# EAGLE design MucDuino_Strawberry (EAGLE 6.5.0)
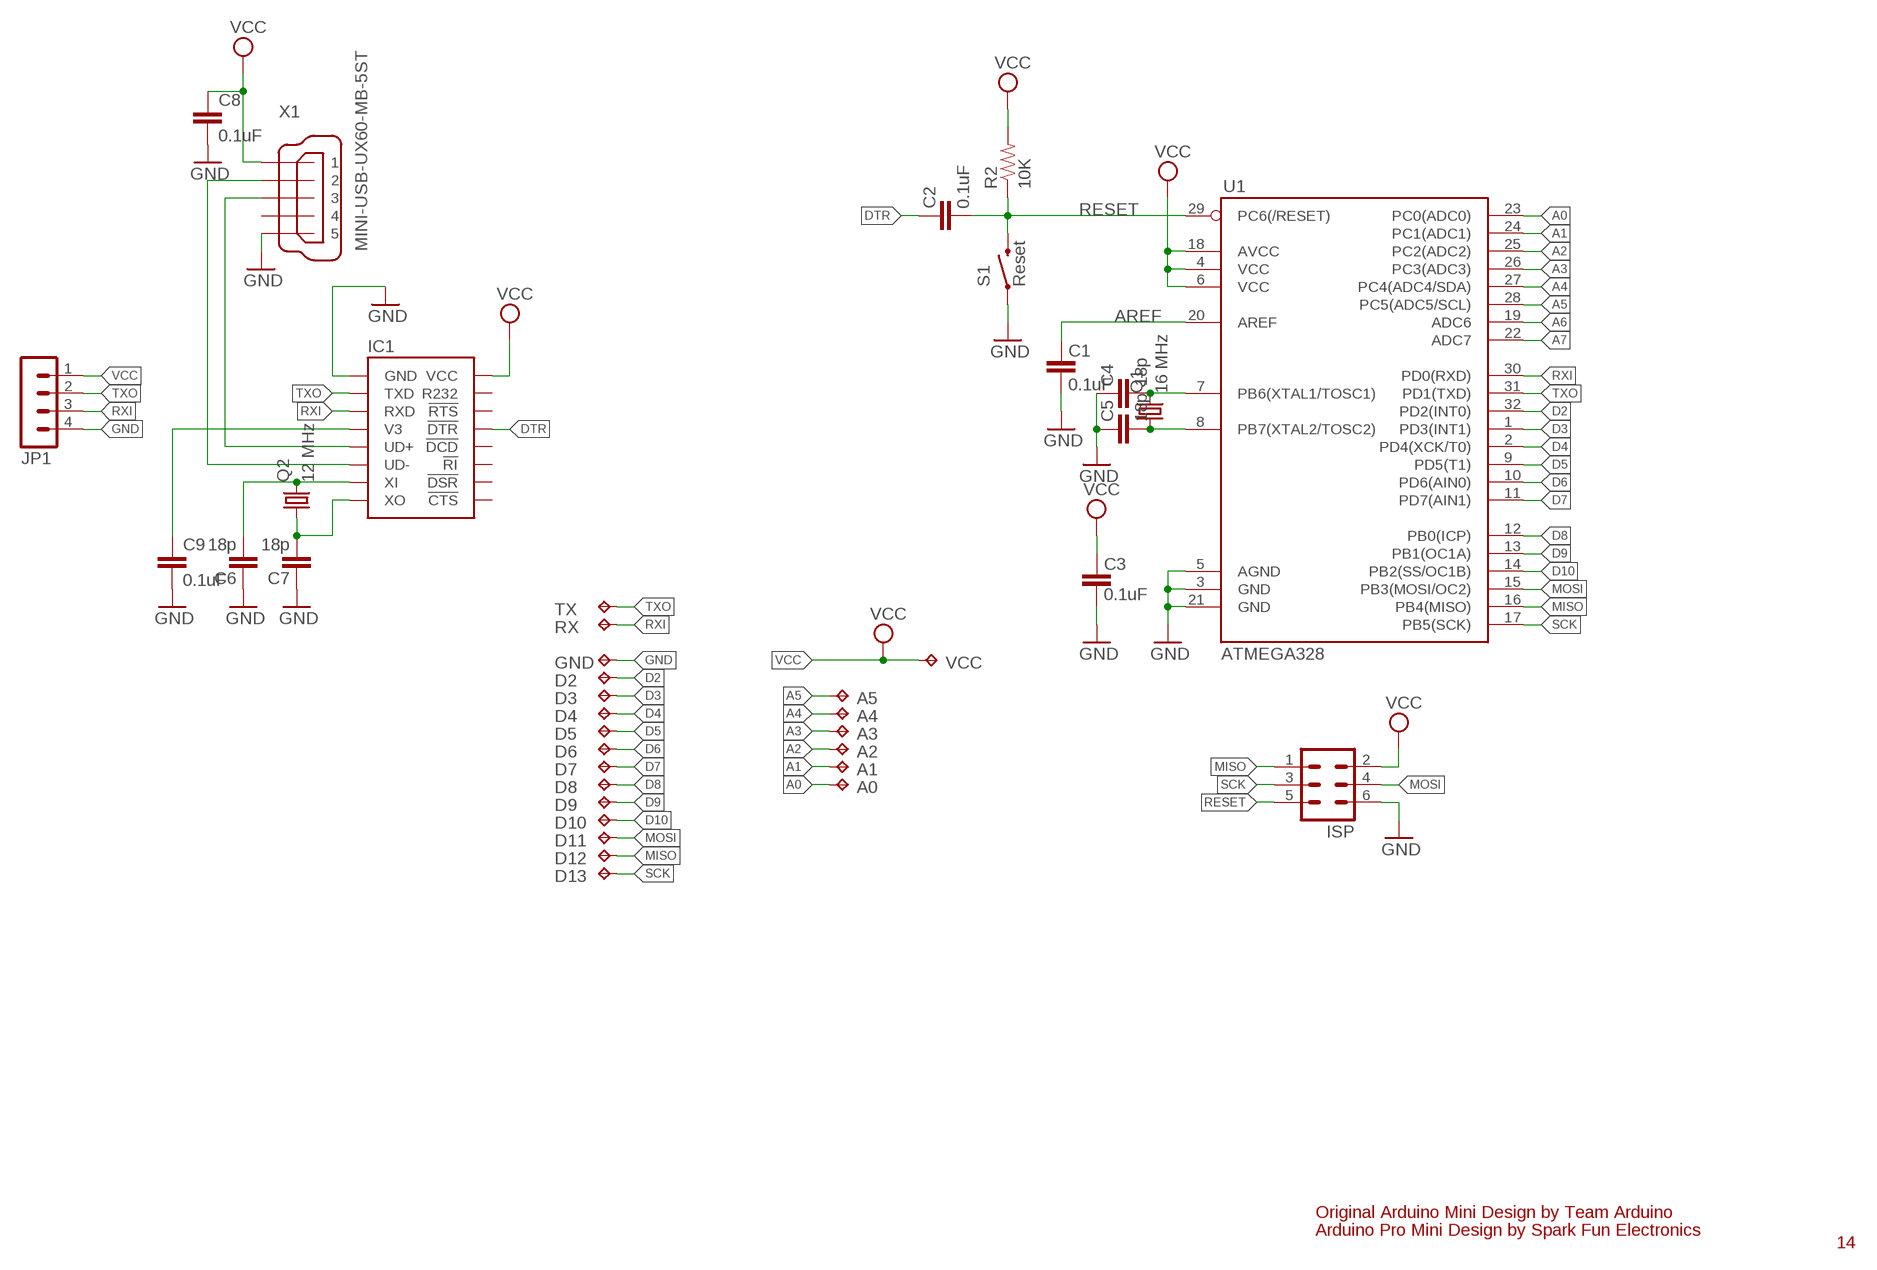
[diagram p0: schematic, sheet 1]

## Parts
A0  TPPAD1-13  [P1-13]
A1  TPPAD1-13  [P1-13]
A2  TPPAD1-13  [P1-13]
A3  TPPAD1-13  [P1-13]
A4  TPPAD1-13  [P1-13]
A5  TPPAD1-13  [P1-13]
C1  0.1uF  CAP0603-CAP  [0603-CAP]
C2  0.1uF  CAP0603-CAP  [0603-CAP]
C3  0.1uF  CAP0603-CAP  [0603-CAP]
C4  18p  CAP0603-CAP  [0603-CAP]
C5  18p  CAP0603-CAP  [0603-CAP]
C6  18p  CAP0603-CAP  [0603-CAP]
C7  18p  CAP0603-CAP  [0603-CAP]
C8  0.1uF  CAP0603-CAP  [0603-CAP]
C9  0.1uF  CAP0603-CAP  [0603-CAP]
D2  TPPAD1-13  [P1-13]
D3  TPPAD1-13  [P1-13]
D4  TPPAD1-13  [P1-13]
D5  TPPAD1-13  [P1-13]
D6  TPPAD1-13  [P1-13]
D7  TPPAD1-13  [P1-13]
D8  TPPAD1-13  [P1-13]
D9  TPPAD1-13  [P1-13]
D10  TPPAD1-13  [P1-13]
D11  TPPAD1-13  [P1-13]
D12  TPPAD1-13  [P1-13]
D13  TPPAD1-13  [P1-13]
GND  TPPAD1-13  [P1-13]
IC1  CH340G  [SOP16-209MM]
ISP  MA03-2  [MA03-2]
JP1  MA04-1  [MA04-1]
Q1  16 MHz  CRYSTALHC49UP  [HC49UP]
Q2  12 MHz  CRYSTALHC49UP  [HC49UP]
R2  10K  RESISTOR0603-RES  [0603-RES]
RX  TPPAD1-13  [P1-13]
S1  Reset  SWITCH-MOMENTARY-2SMD-ALT01  [TACTILE-SWITCH-SMD-ALT01]
TX  TPPAD1-13  [P1-13]
U1  ATMEGA328  ATMEGA168  [TQFP32-08]
VCC  TPPAD1-13  [P1-13]
X1  MINI-USB-UX60-MB-5ST  [UX60-MB-5ST]

## Nets
A0: A0.TP U1.23(PC0(ADC0))
A1: A1.TP U1.24(PC1(ADC1))
A2: A2.TP U1.25(PC2(ADC2))
A3: A3.TP U1.26(PC3(ADC3))
A4: A4.TP U1.27(PC4(ADC4/SDA))
A5: A5.TP U1.28(PC5(ADC5/SCL))
A6: U1.19(ADC6)
A7: U1.22(ADC7)
AREF: C1.2 U1.20(AREF)
D2: D2.TP U1.32(PD2(INT0))
D3: D3.TP U1.1(PD3(INT1))
D4: D4.TP U1.2(PD4(XCK/T0))
D5: D5.TP U1.9(PD5(T1))
D6: D6.TP U1.10(PD6(AIN0))
D7: D7.TP U1.11(PD7(AIN1))
D8: D8.TP U1.12(PB0(ICP))
D9: D9.TP U1.13(PB1(OC1A))
D10: D10.TP U1.14(PB2(SS/OC1B))
DTR: C2.2 IC1.P$13(!DTR)
GND [vcc]: C1.1 C3.1 C4.2 C5.2 C6.2 C7.2 C8.2 C9.2 GND.TP IC1.P$1(GND) ISP.6 JP1.4 S1.1 S1.2 U1.3(GND) U1.5(AGND) U1.21(GND) X1.5
MISO: D12.TP ISP.1 U1.16(PB4(MISO))
MOSI: D11.TP ISP.4 U1.15(PB3(MOSI/OC2))
N$1: C5.1 Q1.1 U1.8(PB7(XTAL2/TOSC2))
N$2: C4.1 Q1.2 U1.7(PB6(XTAL1/TOSC1))
N$3: C9.1 IC1.P$4(V3)
N$5: C6.1 IC1.P$7(XI) Q2.2
N$6: C7.1 IC1.P$8(XO) Q2.1
N$8: IC1.P$5(UD+) X1.3
N$9: IC1.P$6(UD-) X1.2
RESET: C2.1 ISP.5 R2.1 S1.3 S1.4 U1.29(PC6(/RESET))
RXI: IC1.P$3(RXD) JP1.3 RX.TP U1.30(PD0(RXD))
SCK: D13.TP ISP.3 U1.17(PB5(SCK))
TXO: IC1.P$2(TXD) JP1.2 TX.TP U1.31(PD1(TXD))
VCC: C3.2 C8.1 IC1.P$16(VCC) ISP.2 JP1.1 R2.2 U1.4(VCC) U1.6(VCC) U1.18(AVCC) VCC.TP X1.1
Unconnected: IC1.P$9(!CTS) IC1.P$10(!DSR) IC1.P$11(!RI) IC1.P$12(!DCD) IC1.P$14(!RTS) IC1.P$15(R232) X1.4

## Notes on the sheet
- Original Arduino Mini Design by Team Arduino
- Arduino Pro Mini Design by Spark Fun Electronics
- 14

## Library data of the parts
A0 A1-A5 D2-D13 GND RX TX VCC = testpad:TP: Test pad
C1-C9 = SparkFun:CAP: Capacitor Standard 0603 ceramic capacitor, and 0.1" leaded capacitor.
IC1 = densikit:CH340
ISP = con-lstb:MA03-2: PIN HEADER; OC_FARNELL: unknown; OC_NEWARK: unknown
JP1 = con-lstb:MA04-1: PIN HEADER; OC_FARNELL: unknown; OC_NEWARK: unknown
Q1 Q2 = crystal:CRYSTAL: CRYSTAL; OC_FARNELL: unknown; OC_NEWARK: unknown
R2 = SparkFun:RESISTOR: Resistor Basic schematic elements and footprints for 0603, 1206, and PTH resistors.
S1 = Testing:SWITCH-MOMENTARY-2: Various NO switches- pushbuttons, reed, etc
U1 = SparkFun:ATMEGA168
X1 = con-hirose:MINI-USB-: MINI USB Connector Source: http://www.hirose.co.jp/cataloge_hp/e24000019.pdf; OC_FARNELL: unknown; OC_NEWARK: unknown

## Net classes
0 default: width 0.203 mm
1 vcc: width 0.254 mm

## Board
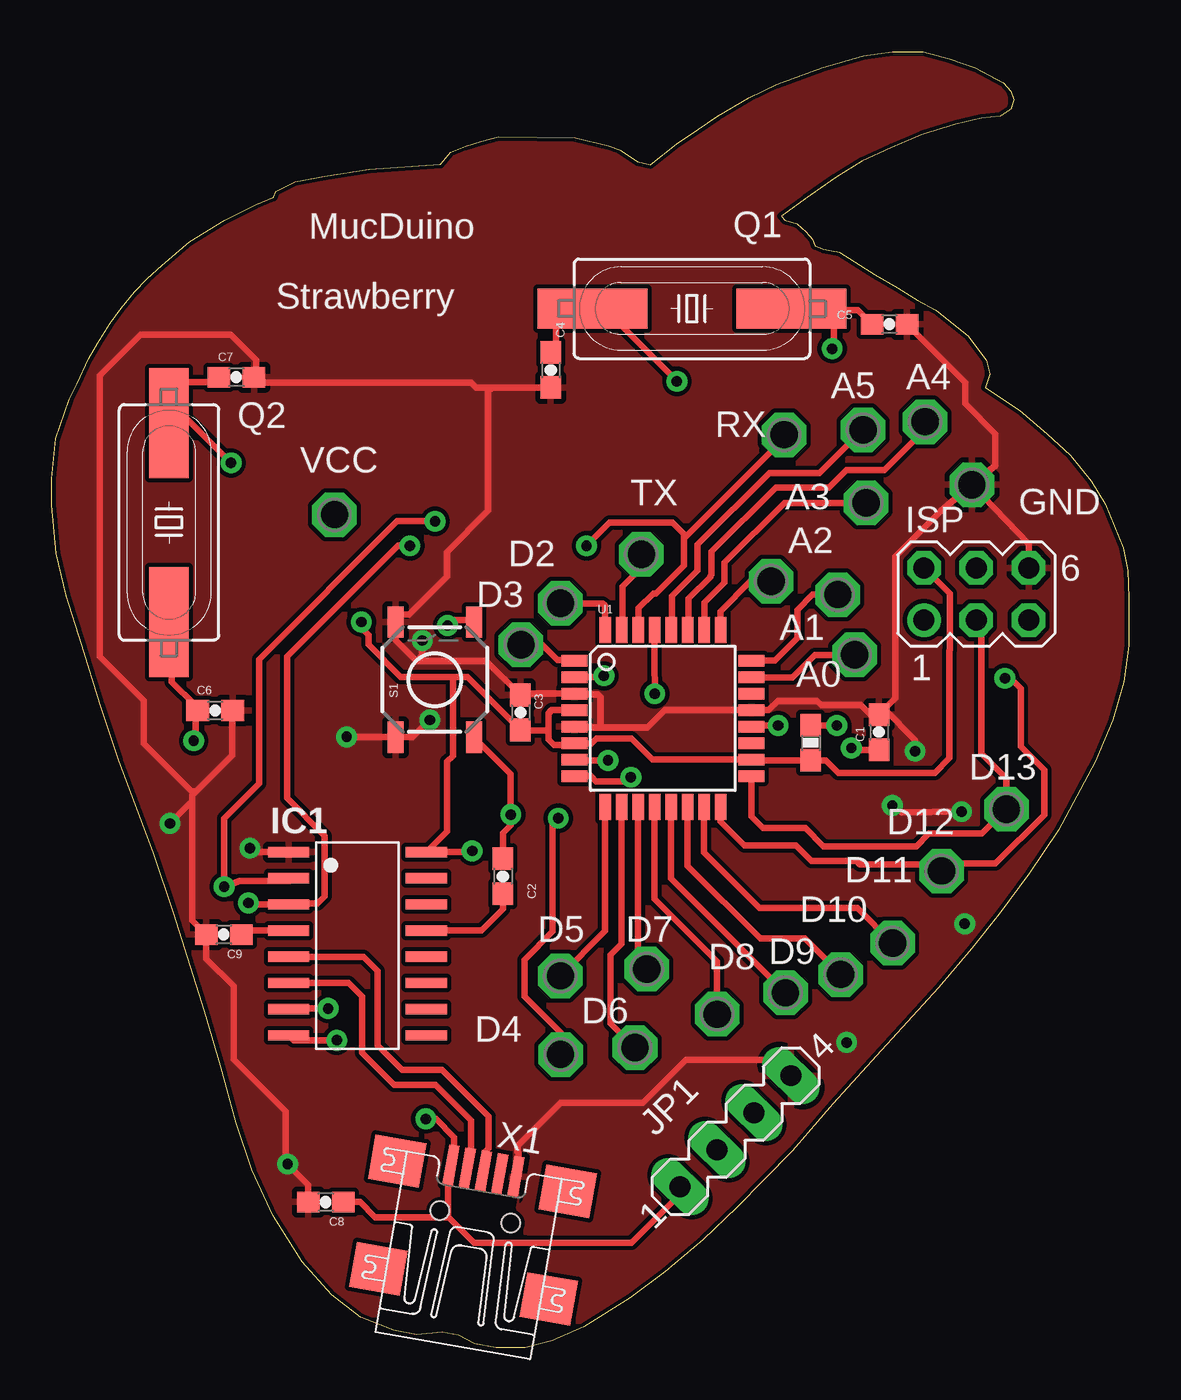
[diagram p1: board, top side]
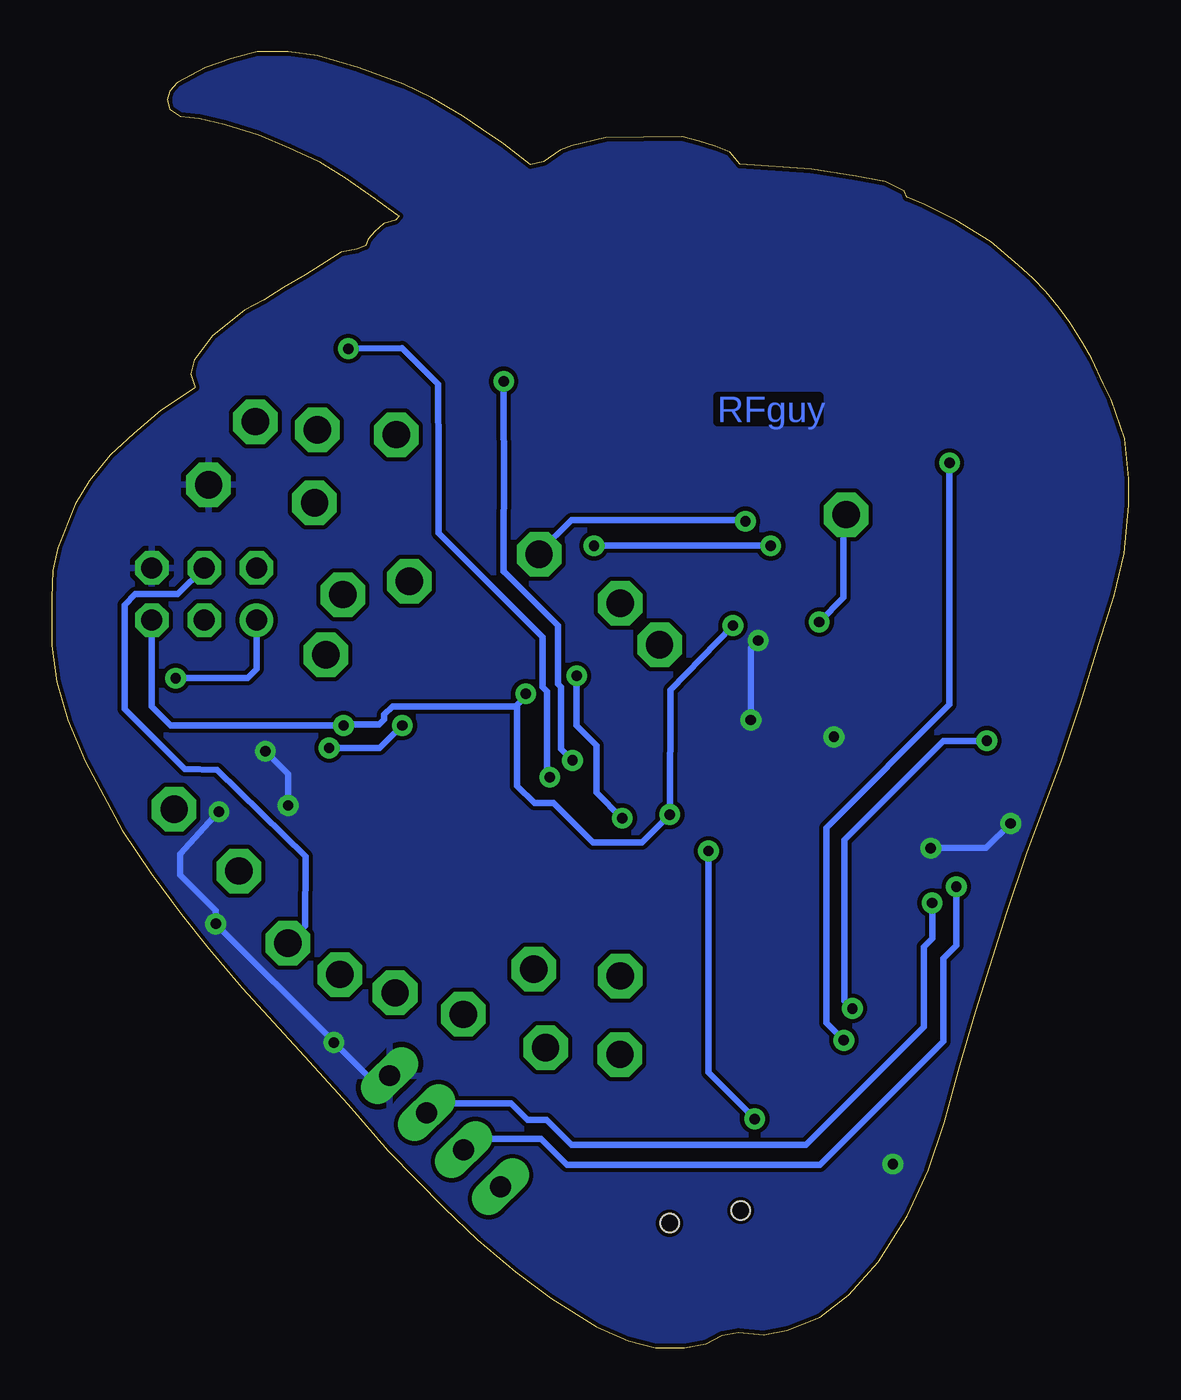
[diagram p2: board, bottom side, seen from below]

Size 52.28 x 62.9 mm. Coordinates in mm from the lower left corner, seen from the top.
Outline: 1.25,46.8 1.8,48 2.24,48.76 2.85,49.72 3.38,50.45 4.03,51.24 4.64,51.87 5.36,52.54 6.7,53.68 8.4,54.73 9.91,55.48 10.77,55.83 10.91,56.13 11.83,56.58 13.25,56.86 15.41,57.18 18.88,57.43 19.37,58.01 20.08,58.3 20.87,58.54 21.7,58.76 25.41,58.73 27.02,58.32 27.6,58.11 28.42,57.56 29.05,57.42 30.34,58.42 31.38,59.12 32.32,59.77 33.83,60.67 35.19,61.32 37.38,62.12 39.38,62.7 40.79,62.9 42.31,62.9 43.57,62.56 44.83,62.11 46.19,61.38 46.54,60.98 46.68,60.56 46.54,60.11 46.04,59.77 45.11,59.67 43.88,59.38 42.24,58.86 40.74,58.24 39.32,57.58 38.03,56.78 36.58,55.77 35.41,54.9 35.59,54.72 36.17,54.54 36.6,54.15 36.93,53.79 37.04,53.47 37.46,53.31 38.22,53.17 39.96,52.07 41.05,51.44 42,50.85 42.9,50.35 44.45,49.12 45.36,47.94 45.53,47.26 45.32,46.59 46.97,45.5 48.29,44.37 49.43,43.31 50.45,42.05 51.13,40.95 51.99,38.8 52.23,37.72 52.28,36.39 52.27,34.09 52.02,32.32 51.49,30.47 50.64,28.45 48.86,25.1 47.44,23.03 45.99,21.05 44.65,19.38 43.02,17.48 40.27,14.44 37.92,11.85 35.94,9.57 33.23,6.8 31.61,5.26 29.76,3.7 28.04,2.42 25.84,1.03 24.28,0.36 22.98,0.02 21.56,0 20.52,0.21 19.74,0.62 18.96,0.77 17.72,0.64 16.6,0.87 14.99,1.5 13.59,2.57 12.17,4.18 10.76,6.41 9.74,8.62 8.96,10.93 8.2,13.69 7.42,16.34 5.93,21.11 4.96,24 3.27,28.54 2.36,31.22 1.46,34.14 0.72,36.5 0.23,38.54 0,40.9 0,42.17 0.2,44.13 0.87,46.01 1.25,46.8
Copper layers (1*16): Top 0.035mm / dielectric 1.5mm / Bottom 0.035mm
Design rules "SparkFun-2-layer *": minimum track width 7mil, minimum drill 15mil, track to track 8mil, track to pad 8mil, pad to pad 8mil, via to via 8mil, smd to smd 8mil, copper to edge 8mil, drill to drill 8mil, minimum pad ring 12mil, minimum via ring 10mil, stop-mask expansion 4mil, vias tented up to drill 20mil, thermal gap 10mil

### Footprints (pad centres in the part's own frame; a part is rotated, then mirrored left to right if it is on the bottom)
P1-13 = drill 1.321 pad 2.159 octagon: TP 0,0
0603-CAP = smd 1.1 x 1: 1 -0.85,0; 2 0.85,0
SOP16-209MM = smd 2 x 0.5: P$1 -3.34,4.54; P$2 -3.34,3.27; P$3 -3.34,2; P$4 -3.34,0.73; P$5 -3.34,-0.54; P$6 -3.34,-1.81; P$7 -3.34,-3.08; P$8 -3.34,-4.35; P$9 3.34,-4.35; P$10 3.34,-3.08; P$11 3.34,-1.81; P$12 3.34,-0.54; P$13 3.34,0.73; P$14 3.34,2; P$15 3.34,3.27; P$16 3.34,4.54
MA03-2 = drill 1.016: 1 -2.54,-1.27 | drill 1.016 octagon: 2 -2.54,1.27; 3 0,-1.27; 4 0,1.27; 5 2.54,-1.27; 6 2.54,1.27
MA04-1 = drill 1.016 long: 1 -3.81,0; 2 -1.27,0; 3 1.27,0; 4 3.81,0
HC49UP = smd 5.334 x 1.93: 1 -4.826,0; 2 4.826,0
0603-RES = smd 1.1 x 1: 1 -0.85,0; 2 0.85,0
TACTILE-SWITCH-SMD-ALT01 = smd 1.524 x 0.762: 1 -2.794,1.905; 2 2.794,1.905; 3 -2.794,-1.905; 4 2.794,-1.905
TQFP32-08 = smd 1.27 x 0.559: 1 -4.293,2.8; 2 -4.293,2; 3 -4.293,1.2; 4 -4.293,0.4; 5 -4.293,-0.4; 6 -4.293,-1.2; 7 -4.293,-2; 8 -4.293,-2.8; 17 4.293,-2.8; 18 4.293,-2; 19 4.293,-1.2; 20 4.293,-0.4; 21 4.293,0.4; 22 4.293,1.2; 23 4.293,2; 24 4.293,2.8 | smd 0.559 x 1.27: 9 -2.8,-4.293; 10 -2,-4.293; 11 -1.2,-4.293; 12 -0.4,-4.293; 13 0.4,-4.293; 14 1.2,-4.293; 15 2,-4.293; 16 2.8,-4.293; 25 2.8,4.293; 26 2,4.293; 27 1.2,4.293; 28 0.4,4.293; 29 -0.4,4.293; 30 -1.2,4.293; 31 -2,4.293; 32 -2.8,4.293
UX60-MB-5ST = smd 2 x 0.5: 1 2.25,1.6; 2 2.25,0.8; 3 2.25,0; 4 2.25,-0.8; 5 2.25,-1.6 | smd 2.2 x 2.5: M1 -3.3,-4.2; M2 -3.3,4.2; M3 2,4.2; M4 2,-4.2 | hole 0.9: 0,-1.75; 0,1.75

### Placement (x,y rotation side)
A0  38.97,33.63 270 top
A1  38.15,36.55 270 top
A2  34.92,37.2 270 top
A3  39.52,41 270 top
A4  42.39,44.94 270 top
A5  39.38,44.54 270 top
C1  40.15,29.87 270 top
C2  21.9,22.89 270 top
C3  22.75,30.83 270 top
C4  24.22,47.45 270 top
C5  40.66,49.67 0 top
C6  7.94,30.93 0 top
C7  8.97,47.1 0 top
C8  13.31,7.08 180 top
C9  8.36,20.06 180 top
D2  24.69,36.13 270 top
D3  22.78,34.12 270 top
D4  24.7,14.24 270 top
D5  24.69,18.05 270 top
D6  28.31,14.57 270 top
D7  28.88,18.38 270 top
D8  32.3,16.19 270 top
D9  35.61,17.23 270 top
D10  38.29,18.12 270 top
D11  40.81,19.64 270 top
D12  43.19,23.14 270 top
D13  46.33,26.14 270 top
GND  44.66,41.88 270 top
IC1  14.85,19.52 0 top
ISP  44.87,36.58 0 top
JP1  33.18,10.52 45 top
Q1  31.07,50.42 180 top
Q2  5.7,40.06 270 top
R2  36.84,29.36 270 top
RX  35.55,44.31 270 top
S1  18.6,32.43 90 top
TX  28.62,38.51 270 top
U1  29.66,30.54 0 top
VCC  13.73,40.43 270 top
X1  20.56,6.36 80 top

### Tracks (layer width: path | path; a pad name or v marks a point on that pad's centre or on a via)
A0
  Top 0.305: U1.23 35.95,32.53 37.05,33.63 A0.TP
A1
  Top 0.305: U1.24 35.09,33.35 36.19,34.45 36.19,35.81 36.93,36.55 A1.TP
A2
  Top 0.305: U1.25 32.45,34.85 32.45,35.73 33.92,37.2 A2.TP
A3
  Top 0.305: U1.26 31.67,34.84 31.67,36.16 32.65,37.14 32.65,38.1 35.55,41 A3.TP
A4
  Top 0.305: U1.27 30.91,34.88 30.91,36.35 31.96,37.4 31.96,37.46 32.03,37.53 32.03,38.63 35.14,41.74 37.71,41.74 38.57,42.6 40.42,42.6 42.39,44.57 A4.TP
A5
  Top 0.305: U1.28 30.11,34.88 30.11,36.1 30.1,36.11 30.1,36.48 31.35,37.73 31.35,38.97 34.83,42.45 37.26,42.45 39.35,44.54 A5.TP
AREF  (via drill 0.5)
  Top 0.305: U1.20 34.01,30.2 v35.26,30.2 | v38.81,29.11 38.9,29.02 C1.2
  Bottom 0.305: v35.26,30.2 36.35,29.11 v38.81,29.11
D2
  Top 0.305: U1.32 26.85,34.85 26.85,36.01 26.73,36.13 D2.TP
D3
  Top 0.305: U1.1 25.33,33.38 24.54,33.38 23.8,34.12 D3.TP
D4  (via drill 0.5)
  Top 0.305: v26.8,32.61 26.73,32.54 U1.2 | D4.TP 24.7,15.3 22.94,17.06 22.94,18.84 24.31,20.21 24.31,25.42 v24.59,25.7
  Bottom 0.305: v24.59,25.7 25.83,26.94 25.83,29.23 26.8,30.2 v26.8,32.61
D5
  Top 0.305: U1.9 26.86,20.22 D5.TP
D6
  Top 0.305: U1.10 27.66,19.61 27.12,19.07 27.12,15.76 D6.TP
D7
  Top 0.305: U1.11 28.46,18.8 D7.TP
D8
  Top 0.305: U1.12 29.26,21.78 32.28,18.76 32.28,16.28 32.45,16.11 32.38,16.11 D8.TP
D9
  Top 0.305: U1.13 30.06,22.78 D9.TP
D10
  Top 0.305: U1.14 30.86,23.4 34.4,19.86 36.55,19.86 D10.TP
DTR
  Top 0.305: IC1.P$13 20.86,20.25 21.9,21.29 C2.2
GND  (via drill 0.5)
  Top 0.305: ISP.6 47.41,39 GND.TP | U1.5 25.41,30.1 26.64,30.1 | 26.64,30.1 28.92,30.1 29.76,30.94 U1.21 34.79,30.95 35.24,31.4 37.14,31.4 37.35,31.19 39.27,31.19 39.74,30.72 C1.1 40.42,30.99 | 26.64,30.1 26.64,31.58 26.51,31.71 25.4,31.71 U1.3 22.81,31.74 C3.1 21.09,33.34 17.71,33.34 | 40.42,30.99 40.95,31.52 40.95,38.4 43.16,40.61 GND.TP | GND.TP 45.8,42.8 45.8,44.35 44.34,45.81 44.34,46.84 C5.2 | 16.69,35.05 16.76,34.98 16.76,35.59 17.34,35.59 19.18,37.43 19.18,38.61 21.19,40.62 21.19,46.42 21.37,46.6 | 16.69,35.05 S1.2 | 17.71,33.34 16.69,34.36 16.69,35.05 | v18.35,30.47 17.51,29.63 S1.1 14.34,29.63 v14.32,29.65 | 17.71,33.34 17.99,33.62 v17.99,34.32 | X1.5 22.65,8.42 22.65,9.47 22.6,9.52 22.6,9.8 24.69,11.89 28.7,11.89 30.78,13.97 35.25,13.97 36.01,13.21 JP1.4 | 21.37,46.6 20.6,46.6 20.36,46.84 10.08,46.84 C7.2 9.92,47.2 9.92,47.93 8.69,49.16 4.32,49.16 2.34,47.18 2.34,33.55 4.47,31.42 4.47,29.34 6.81,27 7.01,27 | 21.37,46.6 C4.2 | 6.82,26.53 6.82,20.75 C9.2 7.51,18.88 8.83,17.56 8.83,14.01 11.37,11.47 11.37,9.01 v11.46,8.92 12.46,7.92 C8.2 | 7.01,27 6.82,26.81 6.82,26.53 | 7.01,27 8.76,28.75 8.76,31.07 8.79,31.04 C6.2 | IC1.P$1 9.81,24.06 v9.62,24.25 | 6.82,26.53 v5.74,25.45 | v41.9,28.95 41.9,29.51 40.42,30.99 | v44.16,26.02 41.25,25.98 40.69,26.39 40.69,26.29 40.81,26.17 v40.81,26.31 v40.8,26.32
  Bottom 0.305: v17.99,34.32 18.35,33.96 v18.35,30.47 | v9.62,24.25 6.94,24.25 v5.74,25.45 | v40.8,26.32 40.8,27.85 v41.9,28.95 | JP1.4 36.95,13.21 38.72,14.98 38.72,14.96 v38.58,14.82 38.58,14.85 v44.31,20.58 44.31,21.24 46.03,22.96 46.03,23.96 v44.16,26.02
  pour Top: -2.92,65.61 58.68,65.61 58.68,-2.89 -2.92,-2.89
  pour Bottom: -1.82,67.11 55.68,67.11 55.68,-2.99 -1.82,-2.99
MISO  (via drill 0.5)
  Top 0.305: U1.16 32.46,25.54 32.57,25.43 32.58,25.43 33.62,24.39 36.11,24.39 36.87,23.63 39.07,23.63 39.23,23.47 42.86,23.47 | 42.86,23.47 D12.TP | 42.86,23.47 42.89,23.5 45.8,23.5 48.17,25.87 48.17,28.05 47.04,29.18 47.04,32 46.55,32.49 v46.26,32.49
  Bottom 0.305: v46.26,32.49 v46.25,32.5 42.77,32.5 42.33,32.94 ISP.1
MOSI
  Top 0.305: U1.15 31.66,24.05 34.36,21.35 39.1,21.35 D11.TP
  Bottom 0.305: ISP.4 46.15,36.57 48.21,36.57 48.73,36.05 48.73,30.99 45.83,28.09 44.24,28.05 39.96,23.85 39.98,20.47 D11.TP
N$1  (via drill 0.5)
  Top 0.305: U1.8 25.42,27.69 25.48,27.75 26.17,27.75 26.43,27.49 27.91,27.49 v28.11,27.69 | 34.48,49.67 35.79,50.37 | 35.79,50.37 Q1.1 | v37.88,48.48 37.95,48.55 37.95,50.26 37.84,50.37 | 37.84,50.37 35.79,50.37 | C5.1 39.11,50.37 37.84,50.37
  Bottom 0.305: v28.11,27.69 28.28,27.86 28.24,27.9 28.24,31.86 28.46,32.08 28.46,34.49 33.5,39.53 33.5,43.18 33.52,46.52 33.52,46.77 35.26,48.51 v37.88,48.48
N$2  (via drill 0.5)
  Top 0.305: U1.7 25.4,28.51 v27,28.51 | C4.1 24.48,48.56 24.48,50.36 24.59,50.47 26.45,50.47 | 26.45,50.47 26.34,50.36 26.13,50.36 26.19,50.42 Q1.2 | v30.34,46.9 26.77,50.47 26.45,50.47
  Bottom 0.305: v27,28.51 27.56,29.07 27.56,32.07 27.71,32.22 27.71,35.05 30.32,37.66 30.34,37.66 30.34,40.22 30.33,41.17 v30.34,46.9
N$3
  Top 0.305: C9.1 9.41,20.26 11.73,20.26 11.72,20.25 IC1.P$4
N$5  (via drill 0.5)
  Top 0.305: IC1.P$7 11.54,16.47 v13.42,16.47 | v6.9,29.46 6.99,29.55 6.99,31.03 | Q2.2 5.7,35.17 5.83,35.04 5.83,32.32 6.96,31.19 6.99,31.19 6.99,31.03 | 6.99,31.03 C6.1
  Bottom 0.305: v13.42,16.47 13.8,16.85 13.8,24.66 9,29.46 v6.9,29.46
N$6  (via drill 0.5)
  Top 0.305: C7.1 7.87,46.85 5.64,46.85 5.7,46.79 Q2.1 5.78,44.88 5.87,44.79 5.87,44.53 5.78,44.44 5.78,44.96 5.57,45.17 5.57,45.13 5.83,44.87 Q2.1 5.57,45 6.65,45 v8.71,42.94 | IC1.P$8 11.75,14.93 v13.84,14.93
  Bottom 0.305: v13.84,14.93 14.69,15.78 14.69,25.23 8.71,31.21 v8.71,42.94
N$8
  Top 0.305: X1.3 21.08,8.7 21.08,9.57 21.2,9.69 21.2,11.23 18.94,13.49 17.01,13.49 15.83,14.67 15.83,18.29 15.14,18.98 IC1.P$5
N$9
  Top 0.305: X1.2 20.25,8.8 20.25,9.3 20.36,9.41 20.36,11.04 18.63,12.77 16.61,12.77 15.07,14.31 15.07,17.05 14.41,17.71 IC1.P$6
RESET  (via drill 0.5)
  Top 0.305: R2.1 v38.11,30.2 | v29.27,31.74 29.26,33.43 U1.29 | S1.3 20.6,29.53 | 20.6,29.53 22.28,27.86 v22.28,25.88 22.28,25.36 21.9,24.98 C2.1 | S1.4 20.41,35.31 19.54,35.31 v19.22,35.05 | 20.6,29.52 20.6,29.53
  Bottom 0.305: 29.68,31.19 29.74,31.13 35.74,31.13 36.14,30.73 36.14,30.49 36.38,30.25 38.26,30.25 v38.11,30.2 46.5,30.2 47.43,31.13 47.43,35.29 ISP.5 | 29.68,31.19 29.23,31.64 v29.27,31.74 | 29.68,31.19 29.68,27.27 28.85,26.44 27.93,26.44 26.01,24.52 23.64,24.52 v22.28,25.88 22.26,31.93 v19.22,35.05
RXI  (via drill 0.5)
  Top 0.305: U1.30 28.49,34.86 28.49,35.89 29.2,36.6 29.33,36.6 30.69,37.96 30.69,39.28 | v17.39,38.92 16.81,38.92 11.43,33.54 11.43,26.68 13.26,24.85 13.26,21.91 12.91,21.56 11.55,21.56 IC1.P$3 9.62,21.52 v9.55,21.59 | v25.96,38.92 27.08,40.04 30.13,40.04 30.69,39.48 30.69,39.28 | 30.69,39.28 35.55,44.14 RX.TP
  Bottom 0.305: v17.39,38.92 v25.96,38.92 | JP1.3 33.64,11.86 29.98,11.86 29.19,11.07 28.26,11.07 27.05,9.86 15.68,9.86 9.95,15.59 9.95,19.47 9.55,19.87 v9.55,21.59
SCK
  Top 0.305: U1.17 33.96,25.78 34.52,25.22 36.57,25.22 37.45,24.34 41.96,24.34 42.58,24.96 45.14,24.96 D13.TP 46.33,27.64 45.12,28.85 45.12,35.06 ISP.3
TXO  (via drill 0.5)
  Top 0.305: U1.31 27.7,34.87 27.7,36.95 28.62,37.87 TX.TP | v18.61,40.11 16.77,40.11 10.07,33.41 10.07,27.38 8.38,25.69 v8.38,22.38 9.13,22.66 11.54,22.66 11.51,22.69 IC1.P$2
  Bottom 0.305: v18.61,40.11 18.67,40.17 27.06,40.17 28.62,38.61 TX.TP | JP1.2 31.77,10.14 28.53,10.14 27.28,8.89 14.99,8.89 9.01,14.87 9.01,18.9 8.38,19.53 v8.38,22.38
VCC  (via drill 0.5)
  Top 0.305: 24.11,29.95 24.11,29.52 24.37,29.26 25.29,29.26 U1.6 26.2,29.34 26.44,29.58 28.13,29.58 29.17,28.54 U1.18 33.99,28.51 R2.2 37.58,28.51 38.19,27.9 42.85,27.9 43.57,28.62 43.57,33.85 43.59,33.87 43.59,36.61 42.35,37.85 ISP.2 | 24.11,29.95 24.11,30.78 24.27,30.94 U1.4 | 24.11,29.95 22.78,29.95 C3.2 20.17,32.56 19.48,32.56 | 19.48,32.56 16.94,32.56 15.38,34.12 15.38,34.59 15.03,34.94 v15.03,35.22 | 13.79,40.95 13.79,40.24 13.83,40.28 13.85,40.28 13.73,40.4 VCC.TP | 19.25,6.43 19.25,8.73 X1.1 19.41,8.89 19.41,9.16 19.54,9.29 19.54,10.23 18.66,11.11 v18.16,11.11 | 19.25,6.43 19.25,6.37 20.51,5.11 28.15,5.11 30.49,7.45 JP1.1 | 19.48,32.56 19.48,28.73 19.2,28.45 19.2,25.07 IC1.P$16 20.36,24.06 v20.41,24.11 | C8.1 14.98,7.08 15.71,6.35 19.17,6.35 19.25,6.43
  Bottom 0.305: v15.03,35.22 13.85,36.4 13.85,40.28 13.73,40.4 VCC.TP | v18.16,11.11 20.41,13.36 v20.41,24.11

### Text on the board
Bottom: RFguy
tPlace: MucDuino | Strawberry
tValues: Valid combinations: | 168V / 3.3V Reg / 8MHz | 168 / 5V Reg / 16MHz | 168 / 5V Reg / 20MHz | Mark back accordingly | Arduino Pro Mini